# Altium schematic sheet STEP_MOTOR_ISOLATOR_INPUT.SchDoc
size 420 x 297 mm; SheetNumber: 12; SheetTotal: 19
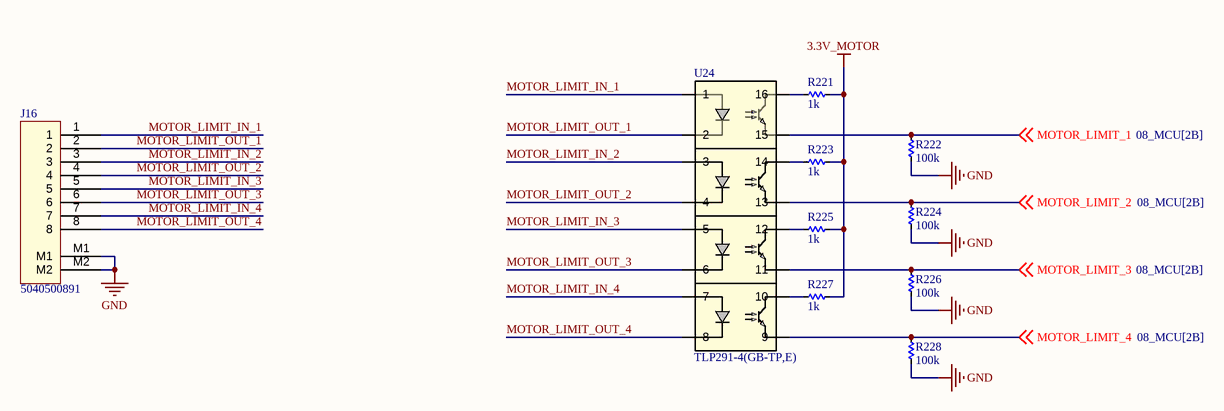
[diagram p0: STEP_MOTOR_ISOLATOR_INPUT.SchDoc]

## Parts
J16  5040500891  [MOLEX_5040500891]
R221  1k  [RES_C_1005X40]
R222  100k  [RES_C_1005X40]
R223  1k  [RES_C_1005X40]
R224  100k  [RES_C_1005X40]
R225  1k  [RES_C_1005X40]
R226  100k  [RES_C_1005X40]
R227  1k  [RES_C_1005X40]
R228  100k  [RES_C_1005X40]
U24  TLP291-4(GB-TP,E)  [SO16_TOS]

## Nets
3.3V_MOTOR: R221.1 R223.1 R225.1 R227.1
GND: J16.M1 J16.M2 R222.1 R224.1 R226.1 R228.1
MOTOR_LIMIT_1: R222.2 U24.15 ; off-sheet MOTOR_LIMIT_1
MOTOR_LIMIT_2: R224.2 U24.13 ; off-sheet MOTOR_LIMIT_2
MOTOR_LIMIT_3: R226.2 U24.11 ; off-sheet MOTOR_LIMIT_3
MOTOR_LIMIT_4: R228.2 U24.9 ; off-sheet MOTOR_LIMIT_4
MOTOR_LIMIT_IN_1: J16.1 U24.1
MOTOR_LIMIT_IN_2: J16.3 U24.3
MOTOR_LIMIT_IN_3: J16.5 U24.5
MOTOR_LIMIT_IN_4: J16.7 U24.7
MOTOR_LIMIT_OUT_1: J16.2 U24.2
MOTOR_LIMIT_OUT_2: J16.4 U24.4
MOTOR_LIMIT_OUT_3: J16.6 U24.6
MOTOR_LIMIT_OUT_4: J16.8 U24.8
NetR221_2: R221.2 U24.16
NetR223_2: R223.2 U24.14
NetR225_2: R225.2 U24.12
NetR227_2: R227.2 U24.10

## Notes on the sheet
- Project
- Sub-system:
- Design by:
- Sheet title:
- Sheet:
- of
- Checked by:
- Approved by:
- Doc no:
- Revision
- Size:
- Date:

## Library data of the parts
J16 = Header 8x1_2M
R221-R228 = _RES_B_2: RES
U24 = TLP291-4GB-TP,E: Description; Manufacturer_Name: Toshiba Electronic Devices & Storage Corp.; Source_Package: TLP291_4; Number_devices_in_Package: 1; Copyright: Copyright (C) 2026 Ultra Librarian. All rights reserved.; Manufacturer_Part_Number: TLP291-4(GB-TP,E); RefDes: Refdes; Type: Type